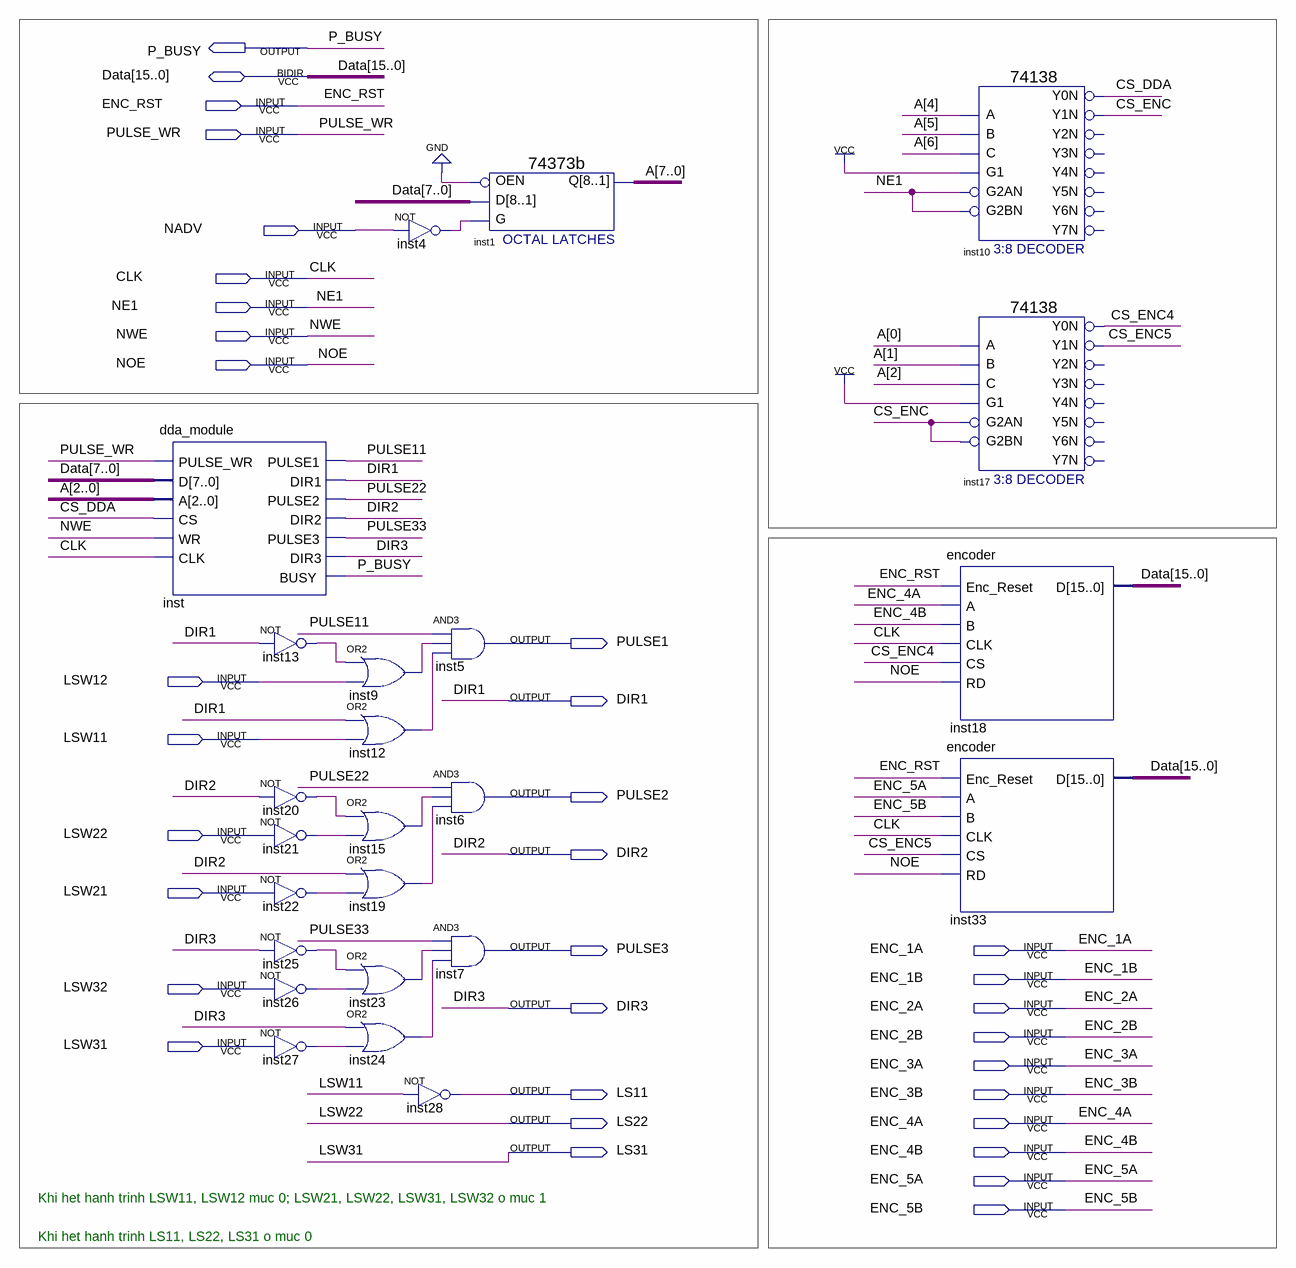
[diagram p0: schematic sheet]
// Quartus schematic xuat_xung.bdf as structural Verilog: 24 symbols, 34 pins
module xuat_xung (
  input  ENC_RST,
  input  PULSE_WR,
  input  NADV,
  input  CLK,
  input  NE1,
  input  NWE,
  input  NOE,
  input  LSW12,
  input  LSW11,
  input  LSW22,
  input  LSW21,
  input  ENC_1A,
  input  ENC_1B,
  input  LSW32,
  input  ENC_2A,
  input  ENC_2B,
  input  LSW31,
  input  ENC_3A,
  input  ENC_3B,
  input  ENC_4A,
  input  ENC_4B,
  input  ENC_5A,
  input  ENC_5B,
  inout  [15:0] Data,
  output P_BUSY,
  output PULSE1,
  output DIR1,
  output PULSE2,
  output DIR2,
  output PULSE3,
  output DIR3,
  output LS11,
  output LS22,
  output LS31
);

  wire CS_DDA, CS_ENC, CS_ENC4, CS_ENC5, inst4_out, inst9_out, inst12_out, inst13_out, inst15_out,
       inst19_out, inst20_out, inst21_out, inst22_out, inst23_out, inst24_out, inst25_out, inst26_out,
       inst27_out, PULSE11, PULSE22, PULSE33;
  wire [7:0] A;

  dda_module inst (
    .PULSE_WR(PULSE_WR), .D(Data[7:0]), .A(A[2:0]), .CS(CS_DDA), .WR(NWE), .CLK(CLK), .PULSE1(PULSE11),
    .DIR1(DIR1), .PULSE2(PULSE22), .DIR2(DIR2), .PULSE3(PULSE33), .DIR3(DIR3), .BUSY(P_BUSY));
  not inst13 (inst13_out, DIR1);
  not inst20 (inst20_out, DIR2);
  not inst21 (inst21_out, LSW22);
  not inst22 (inst22_out, LSW21);
  not inst25 (inst25_out, DIR3);
  not inst26 (inst26_out, LSW32);
  not inst27 (inst27_out, LSW31);
  or inst9 (inst9_out, inst13_out, LSW12);
  or inst12 (inst12_out, DIR1, LSW11);
  or inst15 (inst15_out, inst20_out, inst21_out);
  or inst19 (inst19_out, DIR2, inst22_out);
  or inst23 (inst23_out, inst25_out, inst26_out);
  or inst24 (inst24_out, DIR3, inst27_out);
  not inst4 (inst4_out, NADV);
  and inst5 (PULSE1, PULSE11, inst9_out, inst12_out);
  and inst6 (PULSE2, PULSE22, inst15_out, inst19_out);
  and inst7 (PULSE3, PULSE33, inst23_out, inst24_out);
  not inst28 (LS11, LSW11);
  \74373b  inst1 (.D(Data[7:0]), .G(inst4_out), .OEN(1'b0), .Q(A));
  \74138  inst10 (
    .A(A[4]), .B(A[5]), .G1(1'b1), .C(A[6]), .G2AN(NE1), .G2BN(NE1), .Y0N(CS_DDA), .Y1N(CS_ENC));  // open: Y2N, Y3N, Y4N, Y5N, Y6N, Y7N
  \74138  inst17 (
    .A(A[0]), .B(A[1]), .G1(1'b1), .C(A[2]), .G2AN(CS_ENC), .G2BN(CS_ENC), .Y0N(CS_ENC4), .Y1N(CS_ENC5));  // open: Y2N, Y3N, Y4N, Y5N, Y6N, Y7N
  encoder inst18 (.Enc_Reset(ENC_RST), .A(ENC_4A), .B(ENC_4B), .CLK(CLK), .CS(CS_ENC4), .RD(NOE), .D(Data));
  encoder inst33 (.Enc_Reset(ENC_RST), .A(ENC_5A), .B(ENC_5B), .CLK(CLK), .CS(CS_ENC5), .RD(NOE), .D(Data));

  assign LS22 = LSW22;
  assign LS31 = LSW31;

  // Notes on the sheet:
  //   Khi het hanh trinh LSW11, LSW12 muc 0; LSW21, LSW22, LSW31, LSW32 o muc 1
  //   Khi het hanh trinh LS11, LS22, LS31 o muc 0
endmodule
